# EAGLE design tl494module_1 (EAGLE 8.3.1)
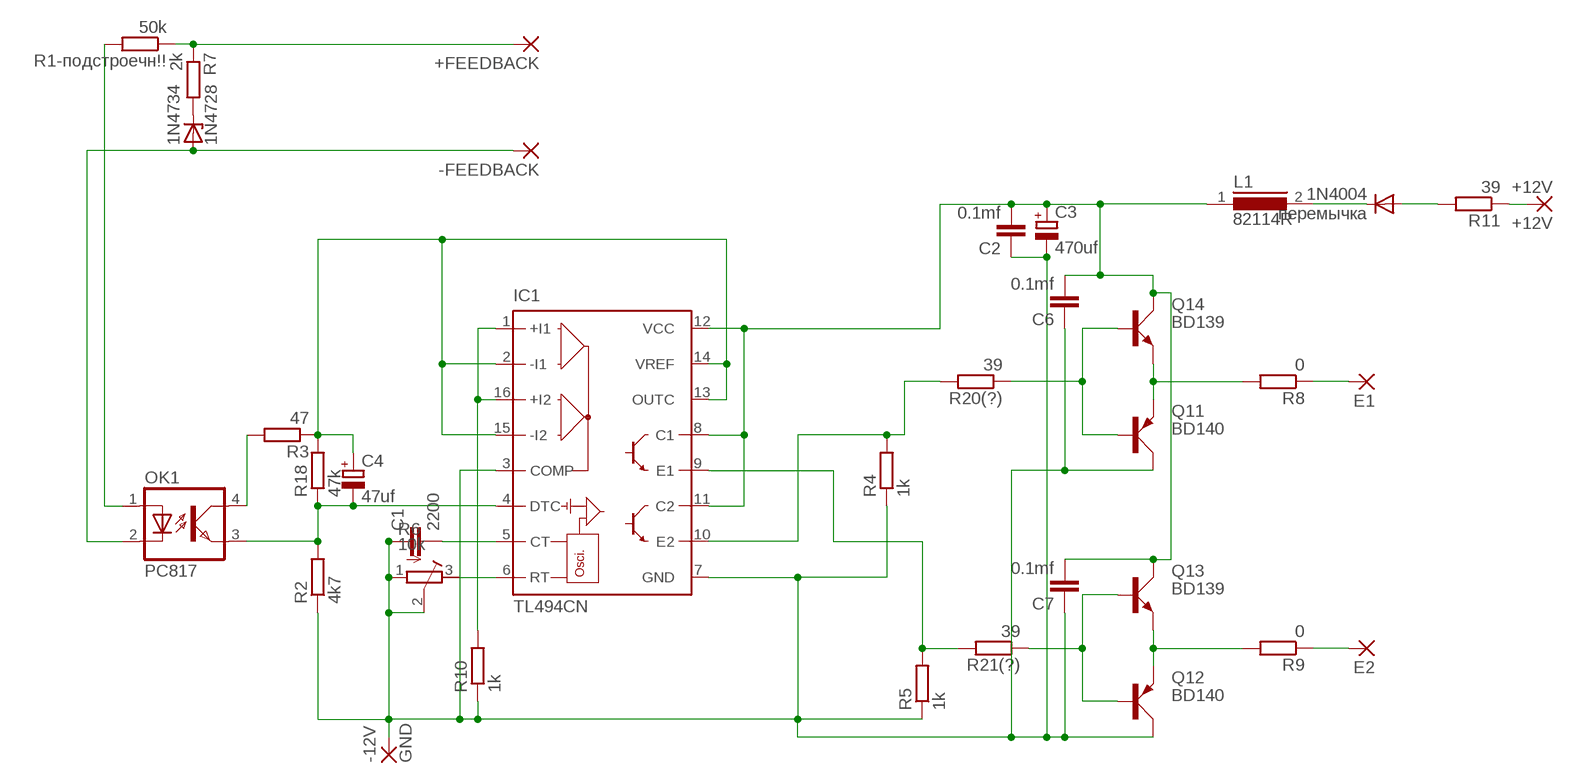
[diagram p0: schematic, sheet 1]

## Parts
1N4734  1N4728  [DO41Z10]
+12V  +12V  3,81/1,1  [3,81/1,1]
+FEEDBACK  3,81/1,1  [3,81/1,1]
-12V  GND  3,81/1,1  [3,81/1,1]
-FEEDBACK  3,81/1,1  [3,81/1,1]
C1  2200  C-EU050-025X075  [C050-025X075]
C2  0.1mf  C-EU050-025X075  [C050-025X075]
C3  470uf  CPOL-EUE2-4  [E2-4]
C4  47uf  CPOL-EUE2-4  [E2-4]
C6  0.1mf  C-EU050-025X075  [C050-025X075]
C7  0.1mf  C-EU050-025X075  [C050-025X075]
E1  3,81/1,1  [3,81/1,1]
E2  3,81/1,1  [3,81/1,1]
IC1  TL494CN  [DIL16]
L1  82114R  [82114R]
OK1  PC817  [DIL04]
Q11  BD140  [TO126AV]
Q12  BD140  [TO126AV]
Q13  BD139  [TO126AV]
Q14  BD139  [TO126AV]
R1-подстроечн!!  50k  R-EU_0204/7  [0204/7]
R2  4k7  R-EU_0204/7  [0204/7]
R3  47  R-EU_0204/7  [0204/7]
R4  1k  R-EU_0204/7  [0204/7]
R5  1k  R-EU_0204/7  [0204/7]
R6  10k  R-TRIMM3296W  [RTRIM3296W]
R7  2k  R-EU_0204/7  [0204/7]
R8  0  R-EU_0204/7  [0204/7]
R9  0  R-EU_0204/7  [0204/7]
R10  1k  R-EU_0204/7  [0204/7]
R11  39  R-EU_0204/7  [0204/7]
R18  47k  R-EU_0204/7  [0204/7]
R20(?)  39  R-EU_0204/7  [0204/7]
R21(?)  39  R-EU_0204/7  [0204/7]
перемычка  1N4004  [DO41-10]

## Nets
N$1: IC1.6(RT) R6.3(E)
N$2: C1.2 IC1.5(CT)
N$3: +FEEDBACK.1(P) R1-подстроечн!!.1 R7.1
N$4: IC1.1(+I1) IC1.16(+I2) R10.2
N$5: 1N4734.C R7.2
N$6: IC1.10(E2) R4.2 R20(?).2
N$7: 1N4734.A -FEEDBACK.1(P) OK1.2(C)
N$8: Q11.E Q14.E R8.2
N$9: OK1.1(A) R1-подстроечн!!.2
N$10: IC1.9(E1) R5.2 R21(?).2
N$11: C4.+ IC1.2(-I1) IC1.13(OUTC) IC1.14(VREF) IC1.15(-I2) R3.1 R18.2
N$12: E1.1(P) R8.1
N$13: E2.1(P) R9.1
N$14: C2.2 C3.+ C6.2 C7.2 IC1.8(C1) IC1.11(C2) IC1.12(VCC) L1.1 Q13.C Q14.C
N$15: Q12.E Q13.E R9.2
N$16: R11.2 перемычка.A
N$17: C4.- IC1.4(DTC) OK1.3(EMIT) R2.2 R18.1
N$18: OK1.4(COL) R3.2
N$19: L1.2 перемычка.C
N$21: -12V.1(P) C1.1 C2.1 C3.- C6.1 C7.1 IC1.3(COMP) IC1.7(GND) Q11.C Q12.C R2.1 R4.1 R5.1 R6.1(A) R6.2(S) R10.1
N$23: +12V.1(P) R11.1
N$26: Q11.B Q14.B R20(?).1
N$29: Q12.B Q13.B R21(?).1

## Library data of the parts
1N4734 = diode:1N4728: Z DIODE 3.3 V, 1W, 5 percent
+12V +FEEDBACK -12V -FEEDBACK E1 E2 = wirepad:3,81/1,1: THROUGH-HOLE PAD
C1 C2 C6 C7 = resistor:C-EU: CAPACITOR, European symbol
C3 C4 = resistor:CPOL-EU: POLARIZED CAPACITOR, European symbol
IC1 = linear:TL494*: SWITCHMODE Pulse Width Modulation Control Circuit NCV494B http://onsemi.com tl494-d.pdf
L1 = inductors:82114R: INDUCTOR
OK1 = optocoupler:PC817: SHARP OPTO COUPLER; MPN: PC817X4J000F; OC_FARNELL: 9707727; OC_NEWARK: 97K7059
Q11 Q12 = transistor-power:BD140: PNP TRANSISTOR
Q13 Q14 = transistor-power:BD139: NPN TRANSISTOR
R1-подстроечн!! R2-R5 R7-R11 R18 R20(?) R21(?) = resistor:R-EU_: RESISTOR, European symbol
R6 = resistor:R-TRIMM: Trimm resistor
перемычка = adafruit:1N4004: DIODE General purpose 1N400x type rectifier (With bigger pads) http://www.ladyada.net/library/pcb/eaglelibrary.html

## Board
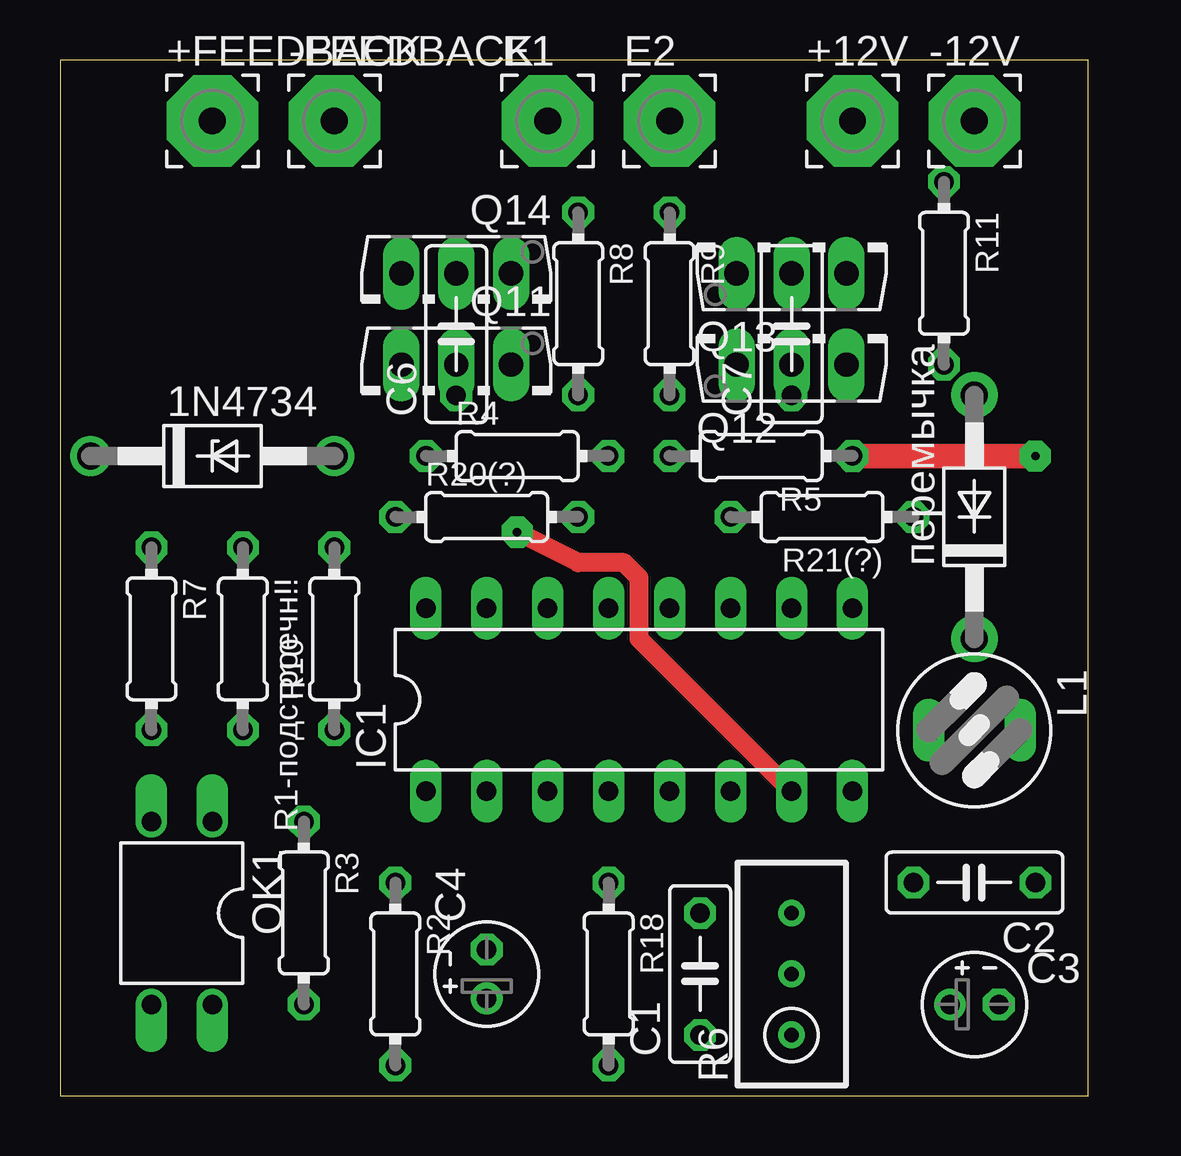
[diagram p1: board, top side]
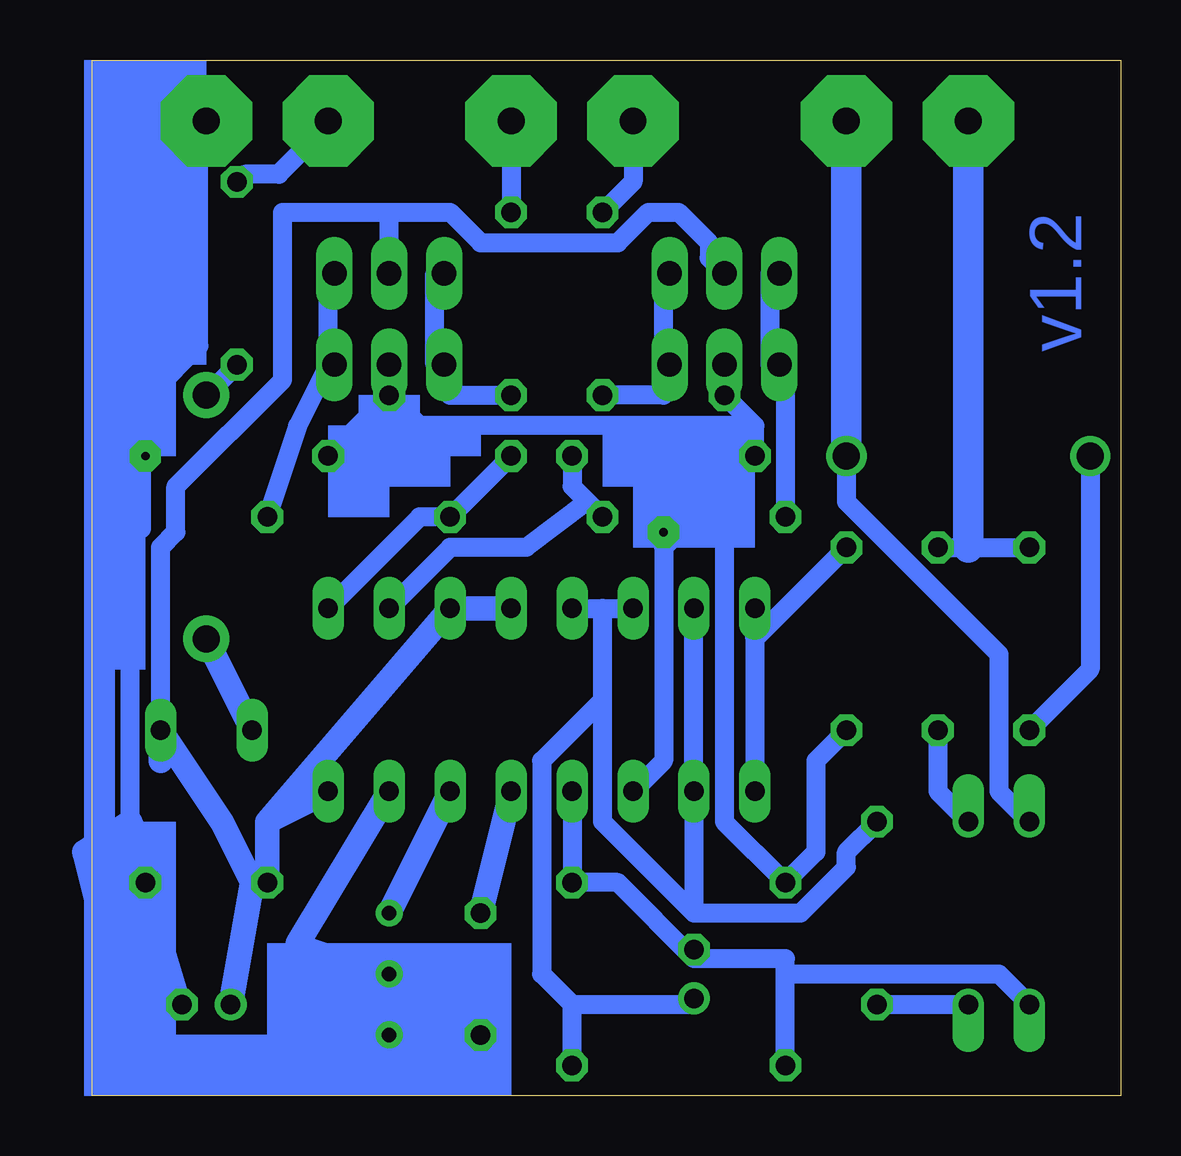
[diagram p2: board, bottom side, seen from below]

Size 42.85 x 43.17 mm. Coordinates in mm from the lower left corner, seen from the top.
Outline: 0,0 42.85,0 42.85,43.17 0,43.17 0,0
Copper layers (1*16): Top 0.035mm / dielectric 1.5mm / Bottom 0.035mm
Design rules "default *": minimum track width 0.8mm, minimum drill 0.35mm, track to track 6mil, track to pad 6mil, pad to pad 6mil, via to via 6mil, smd to smd 6mil, copper to edge 40mil, drill to drill 6mil, minimum pad ring 10mil, minimum via ring 8mil, stop-mask expansion 4mil, vias tented up to drill 0mil, thermal gap 10mil
tRestrict: area 12.7,27.9 to 22.9,36.8; area 24.1,27.9 to 34.3,36.8; area 14,19.1 to 34.3,21.6; area 14,11.4 to 34.3,14; area 31.8,1.3 to 34.3,8.9; area 2.5,30.5 to 10.2,33; area 3.8,38.1 to 40.6,43.2; area 35.6,33 to 40.6,35.6; area 16.5,2.5 to 19,7.6

### Footprints (pad centres in the part's own frame; a part is rotated, then mirrored left to right if it is on the bottom)
DO41Z10 = drill 1.118: A 5.08,0; C -5.08,0
3,81/1,1 = drill 1.118 pad 3.81 octagon: 1 0,0
C050-025X075 = drill 0.813 octagon: 1 -2.54,0; 2 2.54,0
E2-4 = drill 0.813 pad 1.27: + -1.016,0 | drill 0.813 pad 1.27 octagon: - 1.016,0
DIL16 = drill 0.813 long: 1 -8.89,-3.81; 2 -6.35,-3.81; 3 -3.81,-3.81; 4 -1.27,-3.81; 5 1.27,-3.81; 6 3.81,-3.81; 7 6.35,-3.81; 8 8.89,-3.81; 9 8.89,3.81; 10 6.35,3.81; 11 3.81,3.81; 12 1.27,3.81; 13 -1.27,3.81; 14 -3.81,3.81; 15 -6.35,3.81; 16 -8.89,3.81
82114R = drill 0.813 long: 1 0,1.905; 2 0,-1.905
DIL04 = drill 0.813 offset: 1 -1.27,-3.81; 2 1.27,-3.81; 3 1.27,3.81; 4 -1.27,3.81
TO126AV = drill 1.016 long: B 2.286,-1.27; C 0,-1.27; E -2.286,-1.27
0204/7 = drill 0.813 octagon: 1 -3.81,0; 2 3.81,0
RTRIM3296W = drill 0.61: 1 0,-2.54; 2 0,0; 3 0,2.54
DO41-10 = drill 1.118 pad 1.93: A 5.08,0; C -5.08,0

### Placement (x,y rotation side)
1N4734  6.35,26.67 0 top
+12V  33.02,40.64 0 top
+FEEDBACK  6.35,40.64 0 top
-12V  38.1,40.64 0 top
-FEEDBACK  11.43,40.64 0 top
C1  26.67,5.08 90 top
C2  38.1,8.89 180 top
C3  38.1,3.81 0 top
C4  17.78,5.08 90 top
C6  16.51,31.75 90 top
C7  30.48,31.75 90 top
E1  20.32,40.64 0 top
E2  25.4,40.64 0 top
IC1  24.13,16.51 0 top
L1  38.1,15.24 270 top
OK1  5.08,7.62 180 top
Q11  16.51,29.21 180 top
Q12  30.48,31.75 0 top
Q13  30.48,35.56 0 top
Q14  16.51,33.02 180 top
R1-подстроечн!!  7.62,19.05 270 top
R2  13.97,5.08 270 top
R3  10.16,7.62 270 top
R4  19.05,26.67 0 top
R5  29.21,26.67 180 top
R6  30.48,5.08 0 top
R7  3.81,19.05 270 top
R8  21.59,33.02 270 top
R9  25.4,33.02 270 top
R10  11.43,19.05 90 top
R11  36.83,34.29 270 top
R18  22.86,5.08 270 top
R20(?)  17.78,24.13 0 top
R21(?)  31.75,24.13 180 top
перемычка  38.1,24.13 90 top

### Tracks (layer width: path | path; a pad name or v marks a point on that pad's centre or on a via)
N$1
  Bottom 1.016: IC1.6 R6.3
N$2
  Bottom 1.016: IC1.5 C1.2
N$3
  Bottom 0.8: R1-подстроечн!!.1 6.35,22.86 R7.1
  Bottom 1.27: +FEEDBACK.1 6.35,22.86
N$4
  Bottom 0.8: 15.24,19.05 IC1.1 | 15.24,19.05 R10.2 | 15.24,19.05 IC1.16
N$5
  Bottom 0.8: R7.2 1.27,17.78 1N4734.C
N$6
  Bottom 0.8: 22.23,24.76 R20(?).2 | R4.2 22.86,25.4 22.23,24.76 | IC1.10 27.94,22.86 24.77,22.86 22.23,24.76
N$7
  Bottom 0.8: OK1.2 5.08,12.7 5.08,18.41 11.43,24.76 1N4734.A
  Bottom 1.27: 1N4734.A -FEEDBACK.1
N$8
  Bottom 0.8: R8.2 19.05,29.21 19.05,30.48 | 19.05,30.48 19.05,34.29 Q14.E | 19.05,30.48 Q11.E
N$9
  Bottom 0.8: OK1.1 7.62,12.7 R1-подстроечн!!.2
N$10
  Bottom 0.8: R5.2 R21(?).2 29.21,24.13 IC1.9
N$11
  Bottom 0.8: 22.86,3.81 17.78,3.81 C4.+ | R18.2 22.86,3.81 | IC1.13 21.59,20.32 | 21.59,20.32 IC1.14 | R3.1 11.43,10.16 11.43,9.52 13.33,7.62 17.78,7.62 | 17.78,7.62 IC1.2 IC1.15 | 21.59,16.51 21.59,11.43 17.78,7.62 | 21.59,16.51 21.59,20.32 | 22.86,3.81 24.13,5.08 24.13,13.97 21.59,16.51
N$12
  Bottom 0.8: R8.1 20.32,38.1 E1.1
N$13
  Bottom 0.8: E2.1 R9.1
N$14
  Bottom 0.8: C6.2 17.15,34.92 17.15,35.56 18.41,36.83 19.69,36.83 20.95,35.56 26.67,35.56 27.94,36.83 30.48,36.83 | C7.2 30.48,36.83 | 30.48,36.83 34.92,36.83 34.92,29.84 39.37,25.4 39.37,23.49 40,22.86 40,13.97
  Bottom 1.016: IC1.12 IC1.11 35.56,11.43 | 35.56,11.43 C2.2 36.2,8.89 | 35.56,11.43 IC1.8 | 36.2,8.89 C3.+ | 36.2,8.89 37.46,11.43 L1.1 40,13.97
N$15
  Bottom 0.8: R9.2 27.94,29.21 27.94,30.48 Q12.E 28.57,30.48 28.57,34.29 Q13.E
N$16
  Bottom 0.8: R11.2 36.98,30.31 37.94,29.36 перемычка.A
N$17
  Bottom 0.8: IC1.4 R18.1 20.95,8.89 17.78,5.71 | OK1.3 5.08,5.08 13.97,5.08 | R2.2 13.97,5.08 | 17.78,5.71 13.97,5.71 13.97,5.08 | 17.78,5.71 C4.-
N$18
  Bottom 0.8: R3.2 OK1.4
N$19
  Bottom 1.016: перемычка.C L1.2
N$21  (via drill 0.35 pad 1.3)
  Top 0.8: v19.05,23.49 21.59,22.22 23.49,22.22 24.13,21.59 24.13,19.05 IC1.7
  Top 1.016: R5.1 v40.64,26.67
  Bottom 0.8: R10.1 12.7,13.97 12.7,10.16 R2.1 16.51,11.43 16.51,25.4 | Q12.C C7.1 | C7.1 R5.1 | Q11.C C6.1 15.24,27.94 | IC1.3 19.05,13.97 19.05,22.86 16.51,25.4 | R4.1 16.51,25.4 | R4.1 15.24,27.94 | C7.1 29.21,27.94 15.24,27.94 | C1.1 R6.1 R6.2 34.29,6.35 | R4.1 20.32,26.67 v19.05,23.49 | C2.1 C3.- | -12V.1 38.41,40.31 38.41,31.27 40.32,29.36 40.32,26.98 v40.64,26.67 40.79,26.5 40.79,23.65 41.27,24.44 41.27,11.43
  Bottom 1.016: 34.29,6.35 IC1.7 | 43.18,10.16 C2.1 | C2.1 40.64,10.16 | 43.18,10.16 41.91,5.08 C2.1 | 43.18,10.16 41.91,6.35 C2.1 | 41.91,8.89 40.64,10.16 | 40.64,10.16 41.27,11.43 43.18,10.16
N$23
  Bottom 0.8: R11.1 36.51,38.41 35.08,38.41 33.17,40.31 +12V.1
N$26
  Bottom 0.8: R20(?).1 13.97,30.48 Q11.B 14.6,30.48 14.6,34.29 Q14.B
N$29
  Bottom 0.8: R21(?).1 34.29,27.94 33.02,30.48 | 33.02,30.48 33.02,34.29 Q13.B | 33.02,30.48 Q12.B
(copper drawn outside any net)
  shapes: Bottom area x16

### Text on the board
Bottom: v1.2